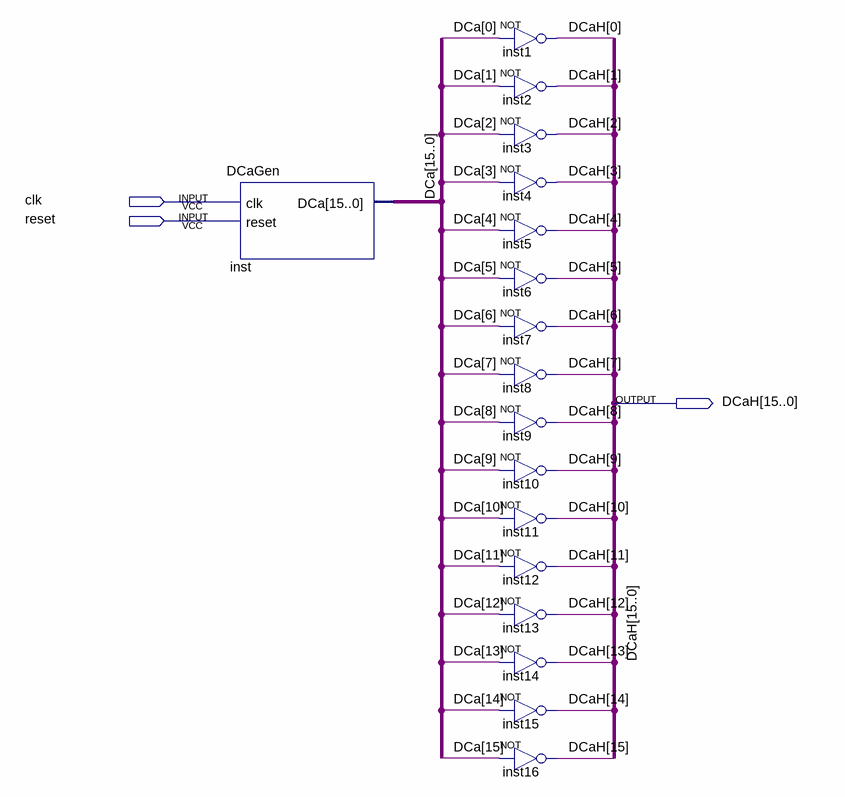
[diagram p0: schematic sheet]
// Quartus schematic DCaH.bdf as structural Verilog: 17 symbols, 3 pins
module DCaH (
  input  clk,
  input  reset,
  output [15:0] DCaH
);

  wire [15:0] DCa;

  DCaGen inst (.clk(clk), .reset(reset), .DCa(DCa));
  not inst1 (DCaH[0], DCa[0]);
  not inst2 (DCaH[1], DCa[1]);
  not inst3 (DCaH[2], DCa[2]);
  not inst4 (DCaH[3], DCa[3]);
  not inst5 (DCaH[4], DCa[4]);
  not inst6 (DCaH[5], DCa[5]);
  not inst7 (DCaH[6], DCa[6]);
  not inst8 (DCaH[7], DCa[7]);
  not inst9 (DCaH[8], DCa[8]);
  not inst10 (DCaH[9], DCa[9]);
  not inst11 (DCaH[10], DCa[10]);
  not inst12 (DCaH[11], DCa[11]);
  not inst13 (DCaH[12], DCa[12]);
  not inst14 (DCaH[13], DCa[13]);
  not inst15 (DCaH[14], DCa[14]);
  not inst16 (DCaH[15], DCa[15]);
endmodule
